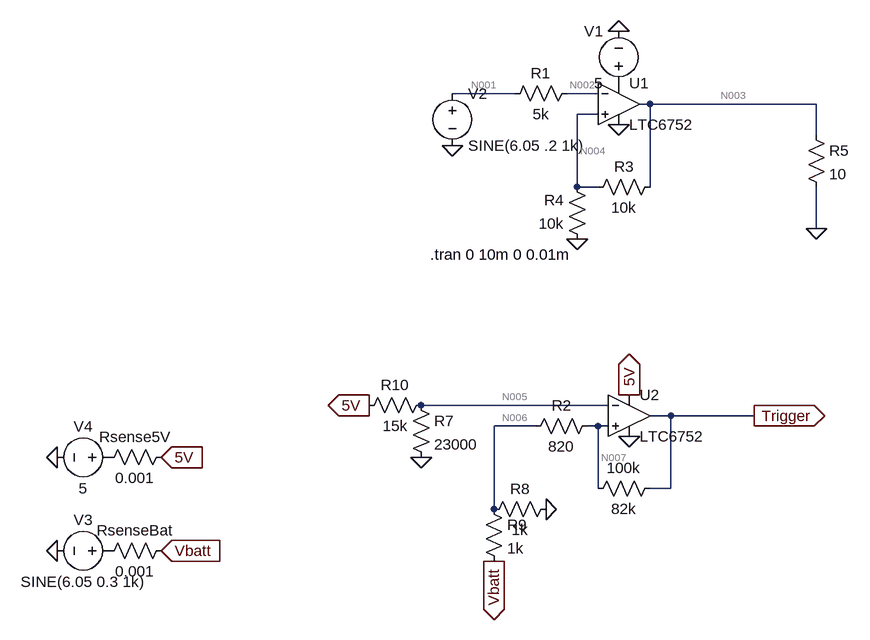
[diagram p0: schematic Draft3.asc]
Draft3.asc, the LTspice schematic file:
Version 4
SHEET 1 880 1004
WIRE 80 160 -16 160
WIRE 208 160 160 160
WIRE 288 176 272 176
WIRE 544 176 288 176
WIRE 208 192 176 192
WIRE 544 224 544 176
WIRE 176 304 176 192
WIRE 208 304 176 304
WIRE 288 304 288 176
WIRE 544 368 544 304
WIRE 224 640 -64 640
WIRE 320 656 288 656
WIRE 448 656 320 656
WIRE 112 672 48 672
WIRE 208 672 192 672
WIRE 224 672 208 672
WIRE 208 768 208 672
WIRE 320 768 320 656
WIRE 320 768 288 768
WIRE 48 800 48 672
FLAG 240 64 0
FLAG 240 208 0
FLAG -16 240 0
FLAG 176 384 0
FLAG 544 368 0
FLAG 256 688 0
FLAG 128 800 0
FLAG -64 720 0
FLAG -624 720 0
FLAG -624 864 0
FLAG -464 864 Vbatt
IOPIN -464 864 In
FLAG 48 880 Vbatt
IOPIN 48 880 Out
FLAG -144 640 5V
IOPIN -144 640 Out
FLAG -464 720 5V
IOPIN -464 720 In
FLAG 256 624 5V
IOPIN 256 624 Out
FLAG 448 656 Trigger
IOPIN 448 656 Out
SYMBOL Comparators\\LTC6752 240 112 R0
SYMATTR InstName U1
SYMBOL voltage 240 160 R180
WINDOW 0 24 96 Left 2
WINDOW 3 24 16 Left 2
WINDOW 123 0 0 Left 0
WINDOW 39 0 0 Left 0
SYMATTR InstName V1
SYMATTR Value 5
SYMBOL voltage -16 144 R0
WINDOW 123 0 0 Left 0
WINDOW 39 0 0 Left 0
SYMATTR InstName V2
SYMATTR Value SINE(6.05 .2 1k)
SYMBOL res 176 144 R90
WINDOW 0 0 56 VBottom 2
WINDOW 3 32 56 VTop 2
SYMATTR InstName R1
SYMATTR Value 5k
SYMBOL res 304 288 R90
WINDOW 0 0 56 VBottom 2
WINDOW 3 32 56 VTop 2
SYMATTR InstName R3
SYMATTR Value 10k
SYMBOL res 192 400 R180
WINDOW 0 36 76 Left 2
WINDOW 3 36 40 Left 2
SYMATTR InstName R4
SYMATTR Value 10k
SYMBOL res 528 208 R0
SYMATTR InstName R5
SYMATTR Value 10
SYMBOL Comparators\\LTC6752 256 592 R0
SYMATTR InstName U2
SYMBOL res 208 656 R90
WINDOW 0 0 56 VBottom 2
WINDOW 3 32 56 VTop 2
SYMATTR InstName R2
SYMATTR Value 820
SYMBOL res 304 752 R90
WINDOW 0 0 56 VBottom 2
WINDOW 3 32 56 VTop 2
SYMATTR InstName 100k
SYMATTR Value 82k
SYMBOL res 32 784 R0
SYMATTR InstName R9
SYMATTR Value 1k
SYMBOL res 144 784 R90
WINDOW 0 0 56 VBottom 2
WINDOW 3 32 56 VTop 2
SYMATTR InstName R8
SYMATTR Value 1k
SYMBOL res -80 624 R0
SYMATTR InstName R7
SYMATTR Value 23000
SYMBOL res -48 624 R90
WINDOW 0 0 56 VBottom 2
WINDOW 3 32 56 VTop 2
SYMATTR InstName R10
SYMATTR Value 15k
SYMBOL voltage -528 720 R90
WINDOW 0 -32 56 VBottom 2
WINDOW 3 32 56 VTop 2
WINDOW 123 0 0 Left 0
WINDOW 39 0 0 Left 0
SYMATTR InstName V4
SYMATTR Value 5
SYMBOL voltage -528 864 R90
WINDOW 0 -32 56 VBottom 2
WINDOW 3 32 56 VTop 2
WINDOW 123 0 0 Left 0
WINDOW 39 0 0 Left 0
SYMATTR InstName V3
SYMATTR Value SINE(6.05 0.3 1k)
SYMBOL res -448 704 R90
WINDOW 0 0 56 VBottom 2
WINDOW 3 32 56 VTop 2
SYMATTR InstName Rsense5V
SYMATTR Value 0.001
SYMBOL res -448 848 R90
WINDOW 0 0 56 VBottom 2
WINDOW 3 32 56 VTop 2
SYMATTR InstName RsenseBat
SYMATTR Value 0.001
TEXT -50 408 Left 2 !.tran 0 10m 0 0.01m

The netlist it stands for:
* Draft3.asc
XU1 N004 N002 P001 0 N003 LTC6752  ; pins In+ In- V+ V- OUT
V1 P001 0 5
V2 N001 0 SINE(6.05 .2 1k)
R1 N002 N001 5k
R3 N003 N004 10k
R4 0 N004 10k
R5 N003 0 10
XU2 N007 N005 5V 0 Trigger LTC6752  ; pins In+ In- V+ V- OUT
R2 N007 N006 820
R§100k Trigger N007 82k
R9 N006 Vbatt 1k
R8 0 N006 1k
R7 N005 0 23000
R10 N005 5V 15k
V4 P002 0 5
V3 P003 0 SINE(6.05 0.3 1k)
Rsense5V 5V P002 0.001
RsenseBat Vbatt P003 0.001
.tran 0 10m 0 0.01m
.lib LTC7.lib
.backanno
.end

* Results of the author's LTspice run, read from the files saved beside the schematic
* Operating Point, zero values left out:
*   V(n002) = 5.729 V
*   V(n004) = 12.53 mV
*   V(n003) = 7.392 µV
*   V(p001) = 5 V
*   V(n001) = 6.05 V
*   V(n005) = 3.039 V
*   V(n007) = 3.057 V
*   V(trigger) = 5 V
*   V(5v) = 5 V
*   V(n006) = 3.037 V
*   V(vbatt) = 6.05 V
*   V(p002) = 5 V
*   V(p003) = 6.05 V
*   I(Rsensebat) = -3.013 mA
*   I(Rsense5v) = -5.6 mA
*   I(R10) = -130.7 µA
*   I(R7) = 132.1 µA
*   I(R8) = -3.037 mA
*   I(R9) = -3.013 mA
*   I(100k) = 23.69 µA
*   I(R2) = 24.45 µA
*   I(R5) = 739.2 nA
*   I(R4) = -1.253 µA
*   I(R3) = -1.252 µA
*   I(R1) = -64.14 µA
*   I(V3) = -3.013 mA
*   I(V4) = -5.6 mA
*   I(V2) = -64.14 µA
*   I(V1) = -5.384 mA
*   Ix(u1:1) = -2.505 µA
*   Ix(u1:2) = 64.14 µA
*   Ix(u1:3) = 5.384 mA
*   Ix(u1:4) = -5.446 mA
*   Ix(u1:5) = 512.8 nA
*   Ix(u2:1) = -755.3 nA
*   Ix(u2:2) = -1.372 µA
*   Ix(u2:3) = 5.469 mA
*   Ix(u2:4) = -5.443 mA
*   Ix(u2:5) = -23.69 µA
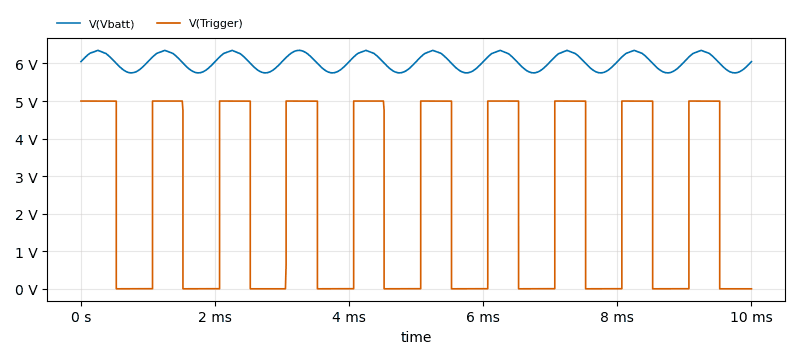
[diagram p1: Transient Analysis of Draft3.asc, plotted from the saved traces]
* Transient Analysis, 1 run:
*   V(Vbatt): min 5.75 V, max 6.349 V, average 6.047 V, rms 6.051 V, last 6.05 V
*   V(Trigger): min 493 µV, max 5 V, average 2.328 V, rms 3.411 V, last 518.4 µV